# Altium project Nucleo_shield_power.PrjPcb
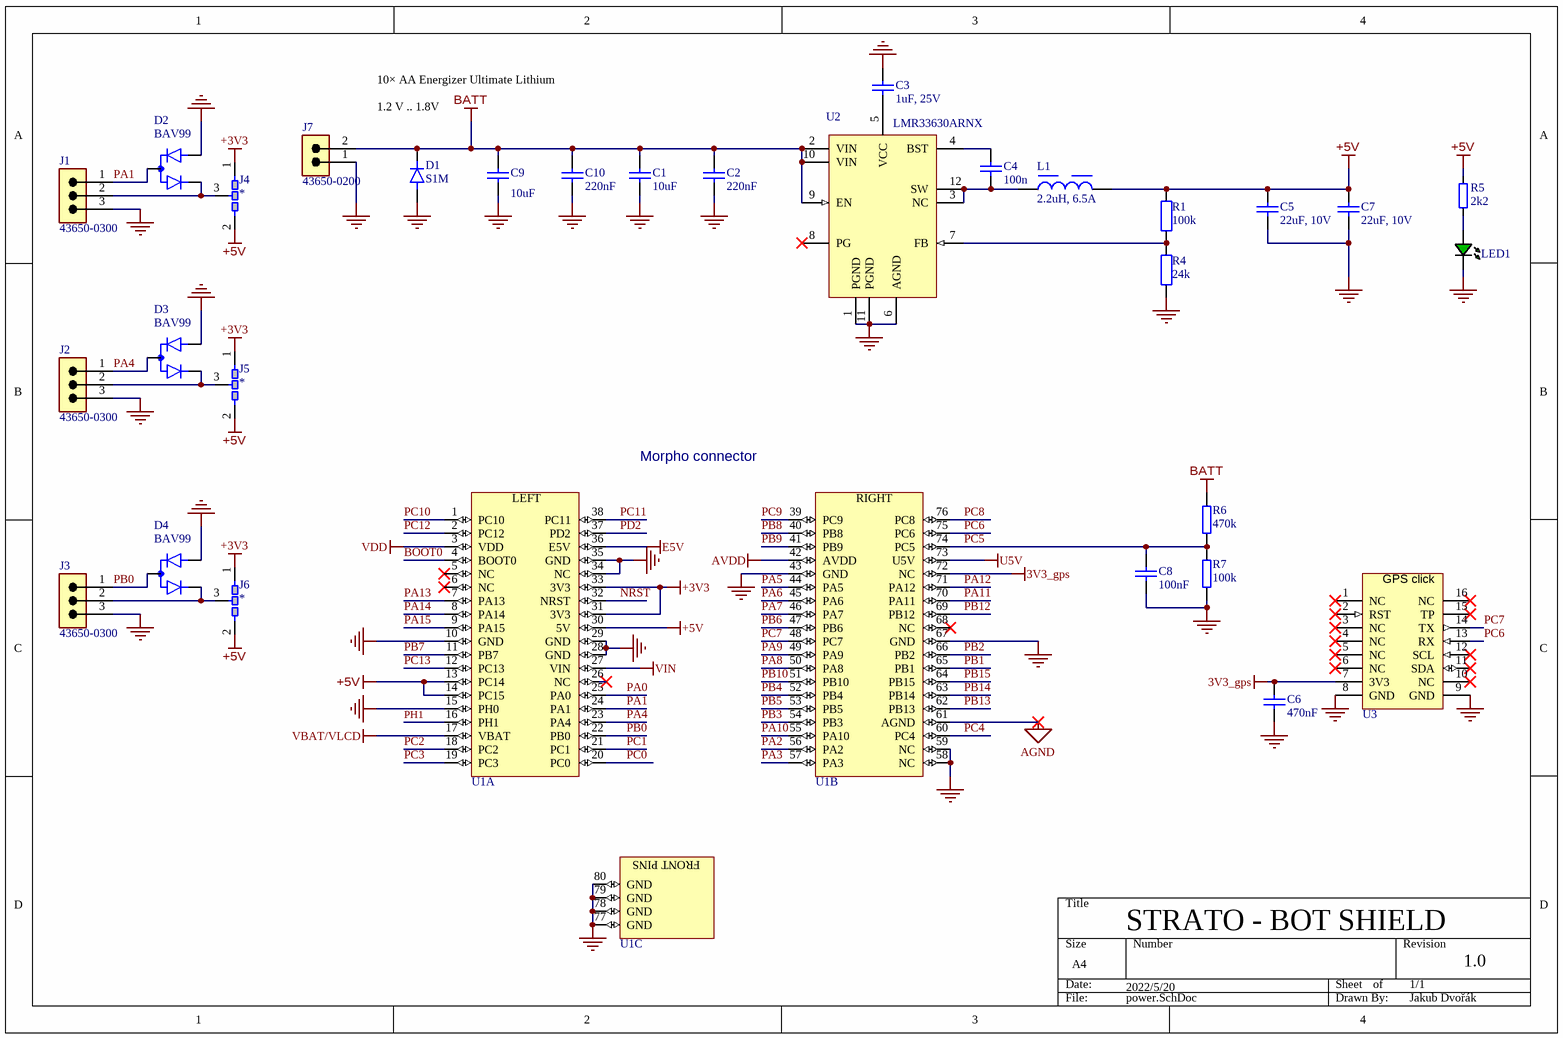
[diagram p0: power.SchDoc]
ApprovedBy: Rani Srani; CheckedBy: Rudolf Jelinek; Date: YYYY-MM-DD; DrawnBy: Jim Beam; Project: XXX; Revision: 001; Title: testtest
1 sheet, 31 parts. Net scope: global (net labels, ports and power ports of the same name join across sheets).
Board file: shield_bot.PcbDoc

## Sheet power.SchDoc: testtest
size A4; Date: YYYY-MM-DD; ApprovedBy: Rani Srani; CheckedBy: Rudolf Jelinek; DrawnBy: Jim Beam; Organization: Medical Technologies CZ a.s.; Revision: 001; Version1: N/A; Version2: N/A; Version3: N/A; Change1description: N/A; Change2description: N/A; Change3description: N/A; Change1DrawnBy: N/A; Change2DrawnBy: N/A; Change3DrawnBy: N/A; Change1CheckedBy: N/A; Change2CheckedBy: N/A; Change3CheckedBy: N/A; PreviusVersion_Chng1: N/A; PreviusVersion_Chng2: N/A; PreviusVersion_Chng3: N/A; Variant1description: Standard assembly; Variant2description: N/A; Variant3description: N/A; Variant4description: N/A; PrimaryCard1: XXXxxxXXX; PrimaryCard2: N/A; PrimaryCard3: N/A; PrimaryCard4: N/A; DocumentName: Docname

### Parts
C1  10uF  [WCAP-CSGP_1206_L3.2W1.6H1.6]
C2  220nF  [WCAP-CSGP_0603_L1.6W0.8H0.8_Reflow]
C3  1uF, 25V  [WCAP-CSGP_0603_L1.6W0.8H0.8_Reflow]
C4  100n  [WCAP-CSGP_0603_L1.6W0.8H0.8_Reflow]
C5  22uF, 10V  [WCAP-CSGP_0805_L2W1.25H1.25]
C6  470nF  [WCAP-CSGP_0805_L2W1.25H1.25]
C7  22uF, 10V  [WCAP-CSGP_0805_L2W1.25H1.25]
C8  100nF  [WCAP-CSGP_0805_L2W1.25H0.8_Reflow]
C9  10uF  [WCAP-CSGP_1206_L3.2W1.6H1.6]
C10  220nF  [WCAP-CSGP_0603_L1.6W0.8H0.8_Reflow]
D1  S1M  [DIOM5127X23N(SMA)]
D2  BAV99  [SOT95P230X110-3N(SOT23)]
D3  BAV99  [SOT95P230X110-3N(SOT23)]
D4  BAV99  [SOT95P230X110-3N(SOT23)]
J1  43650-0300  [MOLEX_43650-0300]
J2  43650-0300  [MOLEX_43650-0300]
J3  43650-0300  [MOLEX_43650-0300]
J4  *  [JUMPER3_SMT_1LAYER]  (no BOM)
J5  *  [JUMPER3_SMT_1LAYER]  (no BOM)
J6  *  [JUMPER3_SMT_1LAYER]  (no BOM)
J7  43650-0200  [MOLEX_43650-0200]
L1  2.2uH, 6.5A  [WE-LHMI_7030]
LED1  green  [0805LEDG]  (value not drawn)
R1  value 100k  [RES_0603]  (hidden comment: Thick film)
R4  value 24k  [RES_0603]  (hidden comment: Thick film)
R5  value 2k2  [RES_0603]  (hidden comment: Thick film)
R6  470k  [RESC2012X06N(SMR0805)]
R7  100k  [RESC2012X06N(SMR0805)]
U1  NUCLEO F466 MORPHO LEFT  [Nucleo_bot_pads]  (value not drawn)  (parts A,B,C of 3)
U2  LMR33630ARNX  [QFN50P200X300X100-12N]
U3  GPS Click  [GPS click - no legs]  (value not drawn)

### Nets
3V3_gps: C6.2 U1.72(NC) U3.7(3V3)
+3V3: J4.1 J5.1 J6.1 U1.31(3V3) U1.33(3V3)
+5V: C5.2 C7.2 J4.2 J5.2 J6.2 L1.2 R1.2 R5.2 U1.13(PC14) U1.14(PC15) U1.30(5V)
AGND: U1.61(AGND)
AVDD: U1.42(AVDD)
BATT: C1.2 C2.2 C9.2 C10.2 D1.1(C) J7.2 R6.2 U2.2(VIN) U2.9(EN) U2.10(VIN)
E5V: U1.36(E5V)
GND: C1.1 C2.1 C3.2 C5.1 C6.1 C7.1 C8.1 C9.1 C10.1 D1.2(A) D2.1(A1) D3.1(A1) D4.1(A1) J1.3 J2.3 J3.3 J7.1 LED1.K R4.1 R7.1 U1.10(GND) U1.15(PH0) U1.28(GND) U1.29(GND) U1.34(NC) U1.35(GND) U1.43(GND) U1.58(NC) U1.59(NC) U1.67(GND) U1.77(GND) U1.78(GND) U1.79(GND) U1.80(GND) U2.1(PGND) U2.6(AGND) U2.11(PGND) U3.8(GND) U3.9(GND)
U5V: U1.73(U5V)
VBAT/VLCD: U1.17(VBAT)
VDD: U1.3(VDD)
VIN: U1.27(VIN)
BOOT0: U1.4(BOOT0)
NRST: U1.32(NRST)
PA0: U1.25(PA0)
PA1: D2.3(C1A2) J1.1 U1.24(PA1)
PA2: U1.56(PA2)
PA3: U1.57(PA3)
PA4: D3.3(C1A2) J2.1 U1.23(PA4)
PA5: U1.44(PA5)
PA6: U1.45(PA6)
PA7: U1.46(PA7)
PA8: U1.50(PA8)
PA9: U1.49(PA9)
PA10: U1.55(PA10)
PA11: U1.70(PA11)
PA12: U1.71(PA12)
PA13: U1.7(PA13)
PA14: U1.8(PA14)
PA15: U1.9(PA15)
PB0: D4.3(C1A2) J3.1 U1.22(PB0)
PB1: U1.65(PB1)
PB2: U1.66(PB2)
PB3: U1.54(PB3)
PB4: U1.52(PB4)
PB5: U1.53(PB5)
PB6: U1.47(PB6)
PB7: U1.11(PB7)
PB8: U1.40(PB8)
PB9: U1.41(PB9)
PB10: U1.51(PB10)
PB12: U1.69(PB12)
PB13: U1.62(PB13)
PB14: U1.63(PB14)
PB15: U1.64(PB15)
PC0: U1.20(PC0)
PC1: U1.21(PC1)
PC2: U1.18(PC2)
PC3: U1.19(PC3)
PC4: U1.60(PC4)
PC5: C8.2 R6.1 R7.2 U1.74(PC5)
PC6: U1.75(PC6) U3.13(RX)
PC7: U1.48(PC7) U3.14(TX)
PC8: U1.76(PC8)
PC9: U1.39(PC9)
PC10: U1.1(PC10)
PC11: U1.38(PC11)
PC12: U1.2(PC12)
PC13: U1.12(PC13)
PD2: U1.37(PD2)
PH1: U1.16(PH1)
NetC3_1: C3.1 U2.5(VCC)
NetC4_1: C4.1 L1.1 U2.3(NC) U2.12(SW)
NetC4_2: C4.2 U2.4(BST)
NetD2_2: D2.2(C2) J1.2 J4.3
NetD3_2: D3.2(C2) J2.2 J5.3
NetD4_2: D4.2(C2) J3.2 J6.3
NetLED1_A: LED1.A R5.1
NetR1_1: R1.1 R4.2 U2.7(FB)

Not connected (* = marked no-connect by the designer): U1 5(NC)* 6(NC)* 26(NC)* 68(NC)*; U2 8(PG)*; U3 1(NC)* 2(RST)* 3(NC)* 4(NC)* 5(NC)* 6(NC)* 10(NC)* 11(SDA)* 12(SCL)* 15(TP)* 16(NC)*

### Notes on the sheet
- 10× AA Energizer Ultimate Lithium
- 1.2 V .. 1.8V
- Morpho connector
- STRATO - BOT SHIELD
- 2022/5/20
- 1/1
- 1.0
- Jakub Dvořák
- Číslo výkresu /drawing number/:
- Nazev listu/sheet name/:
- DPS projekt/PCB project/:
- Kreslil /drawn by/ :
- Kontroloval /checked by/:
- Schvalil /approved by/:
- Podpis /signature/:
- Datum /date/:
- List /sheet/:
- /
- (in symbol GPS Click) GPS click
- (in symbol NUCLEO F466 MORPHO LEFT, part A) LEFT
- (in symbol NUCLEO F466 MORPHO LEFT, part B) RIGHT
- (in symbol NUCLEO F466 MORPHO LEFT, part C) FRONT PINS

### Library data of the parts
C1 C9 = 885012108022: WCAP-CSGP Multilayer Ceramic Chip Capacitor, General Purpose, size 1206, X5R, 10uF, 50V; Manufacturer: Wurth Elektronik; Capacitance Tolerance: +/-10%; Dissipation Factor: 10%; Isolation Resistance: 0.005GOhm; Technical Reference: X5R1206106K050DFCT10000; Capacitance: 10uF; Ceramic Type: X5R; ComponentLink1Description: Manufacturer Link; ComponentLink1URL: http://www.we-online.de; ComponentLink2Description: Datasheet; ComponentLink2URL: https://www.we-online.com/catalog/datasheet/885012108022.pdf; Height: 1.6mm; Length: 3.2mm; Manufacturer Part Number: 885012108022; Mounting Technology: SMT; Operating Temperature max.: 85C; Operating Temperature min.: -55C; Packaging: Tape and Reel; Rated Voltage: 50V; Size: 1206; Width: 1.6mm
C2 C10 = 885012206125: WCAP-CSGP Multilayer Ceramic Chip Capacitor, General Purpose, size 0603, X7R, 220nF, 50V; Manufacturer: Wurth Elektronik; Capacitance Tolerance: +/-5%; Dissipation Factor: 10%; Isolation Resistance: 2.3GOhm; Technical Reference: X7R0603224J050DFCT10000; Capacitance: 220nF; Ceramic Type: X7R; ComponentLink1Description: Manufacturer Link; ComponentLink1URL: http://www.we-online.de; ComponentLink2Description: Datasheet; ComponentLink2URL: https://www.we-online.com/catalog/datasheet/885012206125.pdf; Height: 0.8mm; Length: 1.6mm; Manufacturer Part Number: 885012206125; Mounting Technology: SMT; Operating Temperature max.: 125C; Operating Temperature min.: -55C; Packaging: Tape and Reel; Rated Voltage: 50V; Size: 0603; Width: 0.8mm
C3 = 885012206076: WCAP-CSGP Multilayer Ceramic Chip Capacitor, General Purpose, size 0603, X7R, 1uF, 25V; Manufacturer: Wurth Elektronik; Capacitance Tolerance: +/-10%; Dissipation Factor: 10%; Isolation Resistance: 0.5GOhm; Technical Reference: X7R0603105K025DFCT10000; Capacitance: 1uF; Ceramic Type: X7R; ComponentLink1Description: Manufacturer Link; ComponentLink1URL: http://www.we-online.de; ComponentLink2Description: Datasheet; ComponentLink2URL: https://www.we-online.com/catalog/datasheet/885012206076.pdf; Height: 0.8mm; Length: 1.6mm; Manufacturer Part Number: 885012206076; Mounting Technology: SMT; Operating Temperature max.: 125C; Operating Temperature min.: -55C; Packaging: Tape and Reel; Rated Voltage: 25V; Size: 0603; Width: 0.8mm
C4 = 885012206071R: WCAP-CSGP Multilayer Ceramic Chip Capacitor, General Purpose, size 0603, X7R, 100nF, 25V; Manufacturer: Wurth Elektronik; Capacitance Tolerance: +/-10%; Dissipation Factor: 3.5%; Isolation Resistance: 5GOhm; Technical Reference: X7R0603104K025DFCT20000; Capacitance: 100nF; Ceramic Type: X7R; ComponentLink1Description: Manufacturer Link; ComponentLink1URL: http://www.we-online.de; ComponentLink2Description: Datasheet; ComponentLink2URL: https://www.we-online.com/catalog/datasheet/885012206071R.pdf; Height: 0.8mm; Length: 1.6mm; Manufacturer Part Number: 885012206071R; Mounting Technology: SMT; Operating Temperature max.: 125C; Operating Temperature min.: -55C; Packaging: Tape and Reel; Rated Voltage: 25V; Size: 0603; Width: 0.8mm
C5 C7 = 885012107011: WCAP-CSGP Multilayer Ceramic Chip Capacitor, General Purpose, size 0805, X5R, 22uF, 10V; Manufacturer: Wurth Elektronik; Capacitance Tolerance: +/-20%; Dissipation Factor: 10%; Isolation Resistance: 0.005GOhm; Technical Reference: X5R0805226M010DFCT10000; Capacitance: 22uF; Ceramic Type: X5R; ComponentLink1Description: Manufacturer Link; ComponentLink1URL: http://www.we-online.de; ComponentLink2Description: Datasheet; ComponentLink2URL: https://www.we-online.com/catalog/datasheet/885012107011.pdf; Height: 1.25mm; Length: 2mm; Manufacturer Part Number: 885012107011; Mounting Technology: SMT; Operating Temperature max.: 85C; Operating Temperature min.: -55C; Packaging: Tape and Reel; Rated Voltage: 10V; Size: 0805; Width: 1.25mm
C6 = 885012207102: WCAP-CSGP Multilayer Ceramic Chip Capacitor, General Purpose, size 0805, X7R, 470nF, 50V; Manufacturer: Wurth Elektronik; Capacitance Tolerance: +/-10%; Dissipation Factor: 3%; Isolation Resistance: 1.1GOhm; Technical Reference: X7R0805474K050DFCT10000; Capacitance: 470nF; Ceramic Type: X7R; ComponentLink1Description: Manufacturer Link; ComponentLink1URL: http://www.we-online.de; ComponentLink2Description: Datasheet; ComponentLink2URL: https://www.we-online.com/catalog/datasheet/885012207102.pdf; Height: 1.25mm; Length: 2mm; Manufacturer Part Number: 885012207102; Mounting Technology: SMT; Operating Temperature max.: 125C; Operating Temperature min.: -55C; Packaging: Tape and Reel; Rated Voltage: 50V; Size: 0805; Width: 1.25mm
C8 = 885012207098R: WCAP-CSGP Multilayer Ceramic Chip Capacitor, General Purpose, size 0805, X7R, 100nF, 50V; Manufacturer: Wurth Elektronik; Capacitance Tolerance: +/-10%; Dissipation Factor: 2.5%; Isolation Resistance: 5GOhm; Technical Reference: X7R0805104K050DFCT20000; Capacitance: 100nF; Ceramic Type: X7R; ComponentLink1Description: Manufacturer Link; ComponentLink1URL: http://www.we-online.de; ComponentLink2Description: Datasheet; ComponentLink2URL: https://www.we-online.com/catalog/datasheet/885012207098R.pdf; Height: 0.8mm; Length: 2mm; Manufacturer Part Number: 885012207098R; Mounting Technology: SMT; Operating Temperature max.: 125C; Operating Temperature min.: -55C; Packaging: Tape and Reel; Rated Voltage: 50V; Size: 0805; Width: 1.25mm
D1 = ED+S1MXX0: D; Si; 1000V; 1A; 1x;; KK: ED+S1MXX0
J1-J3 = EJ-0436500300XX0: Con; Micro Fit 3.0; 3x; PCB; Right angle; 250V; 5A; Male; Tin; ??;; Manufacturer: Molex: 436500300; Component_Class: Connector; Status_I: Production; Status_II: Active; Multiplicity: 3; Voltage_Rating_V: 250; Current_Rating_A: 5; Value: 43650-0300; KK: EJ-0436500300XX0; SMD: 0; ComponentLink2URL: I:\datasheets\EJ-0436500300XX0_Molex_DRW_100.pdf; ComponentLink2Description: EJ-0436500300XX0_Molex_DRW_100.pdf; ComponentLink3URL: I:\datasheets\EJ-0436500300XX0_MolexEN100.pdf; ComponentLink3Description: EJ-0436500300XX0_MolexEN100.pdf; Mounting_Style: PCB; Connector_Family: Micro Fit 3.0; Angle: Right angle; Gender: Male; Plating: Tin; ComponentLink1URL: heliosgreen://v1/hegMT/5-MT/Classes(343)/Folders/OpenForm?RecordNumbers=[10524933]; ComponentLink1Description: Helios; System: Connector
J4-J6 = JUMPER_3P: Soldering Jumper, 3 Pins; 01_HODNOTA/POPIS: SHORT CUT; 03_MERITKO: 0.3mm izol. mezera; 04_DOPLNKOVY TEXT: 0.3mm - MOTIV na DPS; Tolerance & Rating: *; Author: JM 1.9.2015; Value: *; SMD: 1
J7 = EJ-43650-0200XX0: Con; Micro Fit 3.0; 2x; PCB; Right angle; 600V; 5A; Male; Nickel; ??;; Manufacturer: MOLEX: 43650-0200; Component_Class: Connector; Status_I: Production; Status_II: Active; Multiplicity: 2; Voltage_Rating_V: 600; Current_Rating_A: 5; Value: 43650-0200; KK: EJ-43650-0200XX0; SMD: 0; ComponentLink2URL: I:\datasheets\EJ-43650-0200XX0_MolexEN100.pdf; ComponentLink2Description: EJ-43650-0200XX0_MolexEN100.pdf; Mounting_Style: PCB; Connector_Family: Micro Fit 3.0; Angle: Right angle; Gender: Male; Plating: Nickel; ComponentLink1URL: heliosgreen://v1/hegMT/5-MT/Classes(343)/Folders/OpenForm?RecordNumbers=[11652171]; ComponentLink1Description: Helios; System: Connector
L1 = 74437346022: WE-LHMI SMT Power Inductor, size 7030, 2.2uH, 6.5A; Manufacturer: Wurth Elektronik; Self Resonant Frequency: 32MHz; DC Resistance typ.: 18mOhm; DC Resistance max.: 20mOhm; Saturation Current @10%: 10A; Saturation Current @30%: 19.1A; ComponentLink1Description: Manufacturer; ComponentLink1URL: http://www.we-online.de; ComponentLink2Description: Datasheet; ComponentLink2URL: https://www.we-online.com/catalog/datasheet/74437346022.pdf; Mounting Technology: SMT; Operating Temperature: -40 to +125degC; Packaging: Tape and Reel; Inductance: 2.2uH; Manufacturer Part Number: 74437346022; Rated Current: 6.5A; Size: 7030; Height: 2.8mm; Length: 6.6mm; Width: 6.6mm
LED1 = LEDG_0805
R1 = RES_100k_5%_0603: 100000.00; Tolerance [%]: ±5; Power Rating [W]: 0.1; Case [EIA]: 0603; Case [Metric]: 1608; Value [Ω]: 100000.00
R4 = RES_24k_5%_0603: 24000.00; Tolerance [%]: ±5; Power Rating [W]: 0.1; Case [EIA]: 0603; Case [Metric]: 1608; Value [Ω]: 24000.00
R5 = RES_2k2_5%_0603: 2200.00; Tolerance [%]: ±5; Power Rating [W]: 0.1; Case [EIA]: 0603; Case [Metric]: 1608; Value [Ω]: 2200.00
R6 = ER+470K0.1WXXF: R; 470k; 0.125W; 1%; 150V; Thick Film; ±100ppm/K; 1x;; Manufacturer: YAGEO: RC0805FR-07470KL;;AVX: CR21-4703F-T;;BC Components: MCU0805-50 1% P5 470k;;PANASONIC: ERJ 6EN F 4703 V;;HaS Lanskroun: CMF0805 470k 1% 100ppm/K; Component_Class: Resistor; Status_I: Production; Status_II: Active; Tolerance_Pct: 1; Voltage_Rating_V: 150; Resistance_Ohm: 470000; Power_Rating_W: 0.125; Temperature_Coefficient_PPMpK: ±100; KK: ER+470K0.1WXXF; Value: 470k; SMD: 1; ComponentLink2URL: i:\DataSheets\ER+0.1WXXF_Yageo.pdf; ComponentLink2Description: ER+0.1WXXF_Yageo.pdf; Multiplicity: 1; Resistor_Type: Thick Film; ComponentLink1URL: heliosgreen://v1/hegMT/5-MT/Classes(343)/Folders/OpenForm?RecordNumbers=[381583]; ComponentLink1Description: Helios
R7 = ER+100K0.1WXXF: R; 100k; 0.125W; 1%; 150V; Thick Film; ±100ppm/K; 1x;; Manufacturer: YAGEO: RC0805FR-10100KL; Component_Class: Resistor; Status_I: Production; Status_II: Active; Tolerance_Pct: 1; Voltage_Rating_V: 150; Resistance_Ohm: 100000; Power_Rating_W: 0.125; Temperature_Coefficient_PPMpK: ±100; KK: ER+100K0.1WXXF; Value: 100k; SMD: 1; ComponentLink2URL: i:\DataSheets\ER+0.1WXXF_Yageo.pdf; ComponentLink2Description: ER+0.1WXXF_Yageo.pdf; Multiplicity: 1; Resistor_Type: Thick Film; ComponentLink1URL: heliosgreen://v1/hegMT/5-MT/Classes(343)/Folders/OpenForm?RecordNumbers=[381474]; ComponentLink1Description: Helios
U2 = EU+LMR33630ARNXXX0: IC; SMPS Regulator/Controller; 3.8V; 36V; 1x;; Manufacturer: Texas Instruments: LMR33630ARNXR;;Texas Instruments: LMR33630ARNXT; Note: 3-A Synchronous Step-Down Voltage Converter; Status_I: Production; Status_II: Active; Multiplicity: 1; Vmin_V: 3.8; Vmax_V: 36; KK: EU+LMR33630ARNXXX0; Value: LMR33630ARNX; Component_Class: IC; SMD: 1; ComponentLink2URL: I:\DataSheets\EU+LMR33630ARNXXX0_TexasInstrumentsEN100.pdf; ComponentLink2Description: EU+LMR33630ARNXXX0_TexasInstrumentsEN100; IC_Type: SMPS Regulator/Controller; ComponentLink1URL: heliosgreen://v1/hegMT/5-MT/Classes(343)/Folders/OpenForm?RecordNumbers=[12689791]; ComponentLink1Description: Helios
D2-D4 = BAV99: ComponentLink1Description: New link; ComponentLink1URL: C:\Users\Public\Documents\Altium\DSH\EDD+BAV99XX0_OnsemiEN100.PDF